# Altium schematic sheet 12 FE-DBG.SchDoc
size 420 x 297 mm
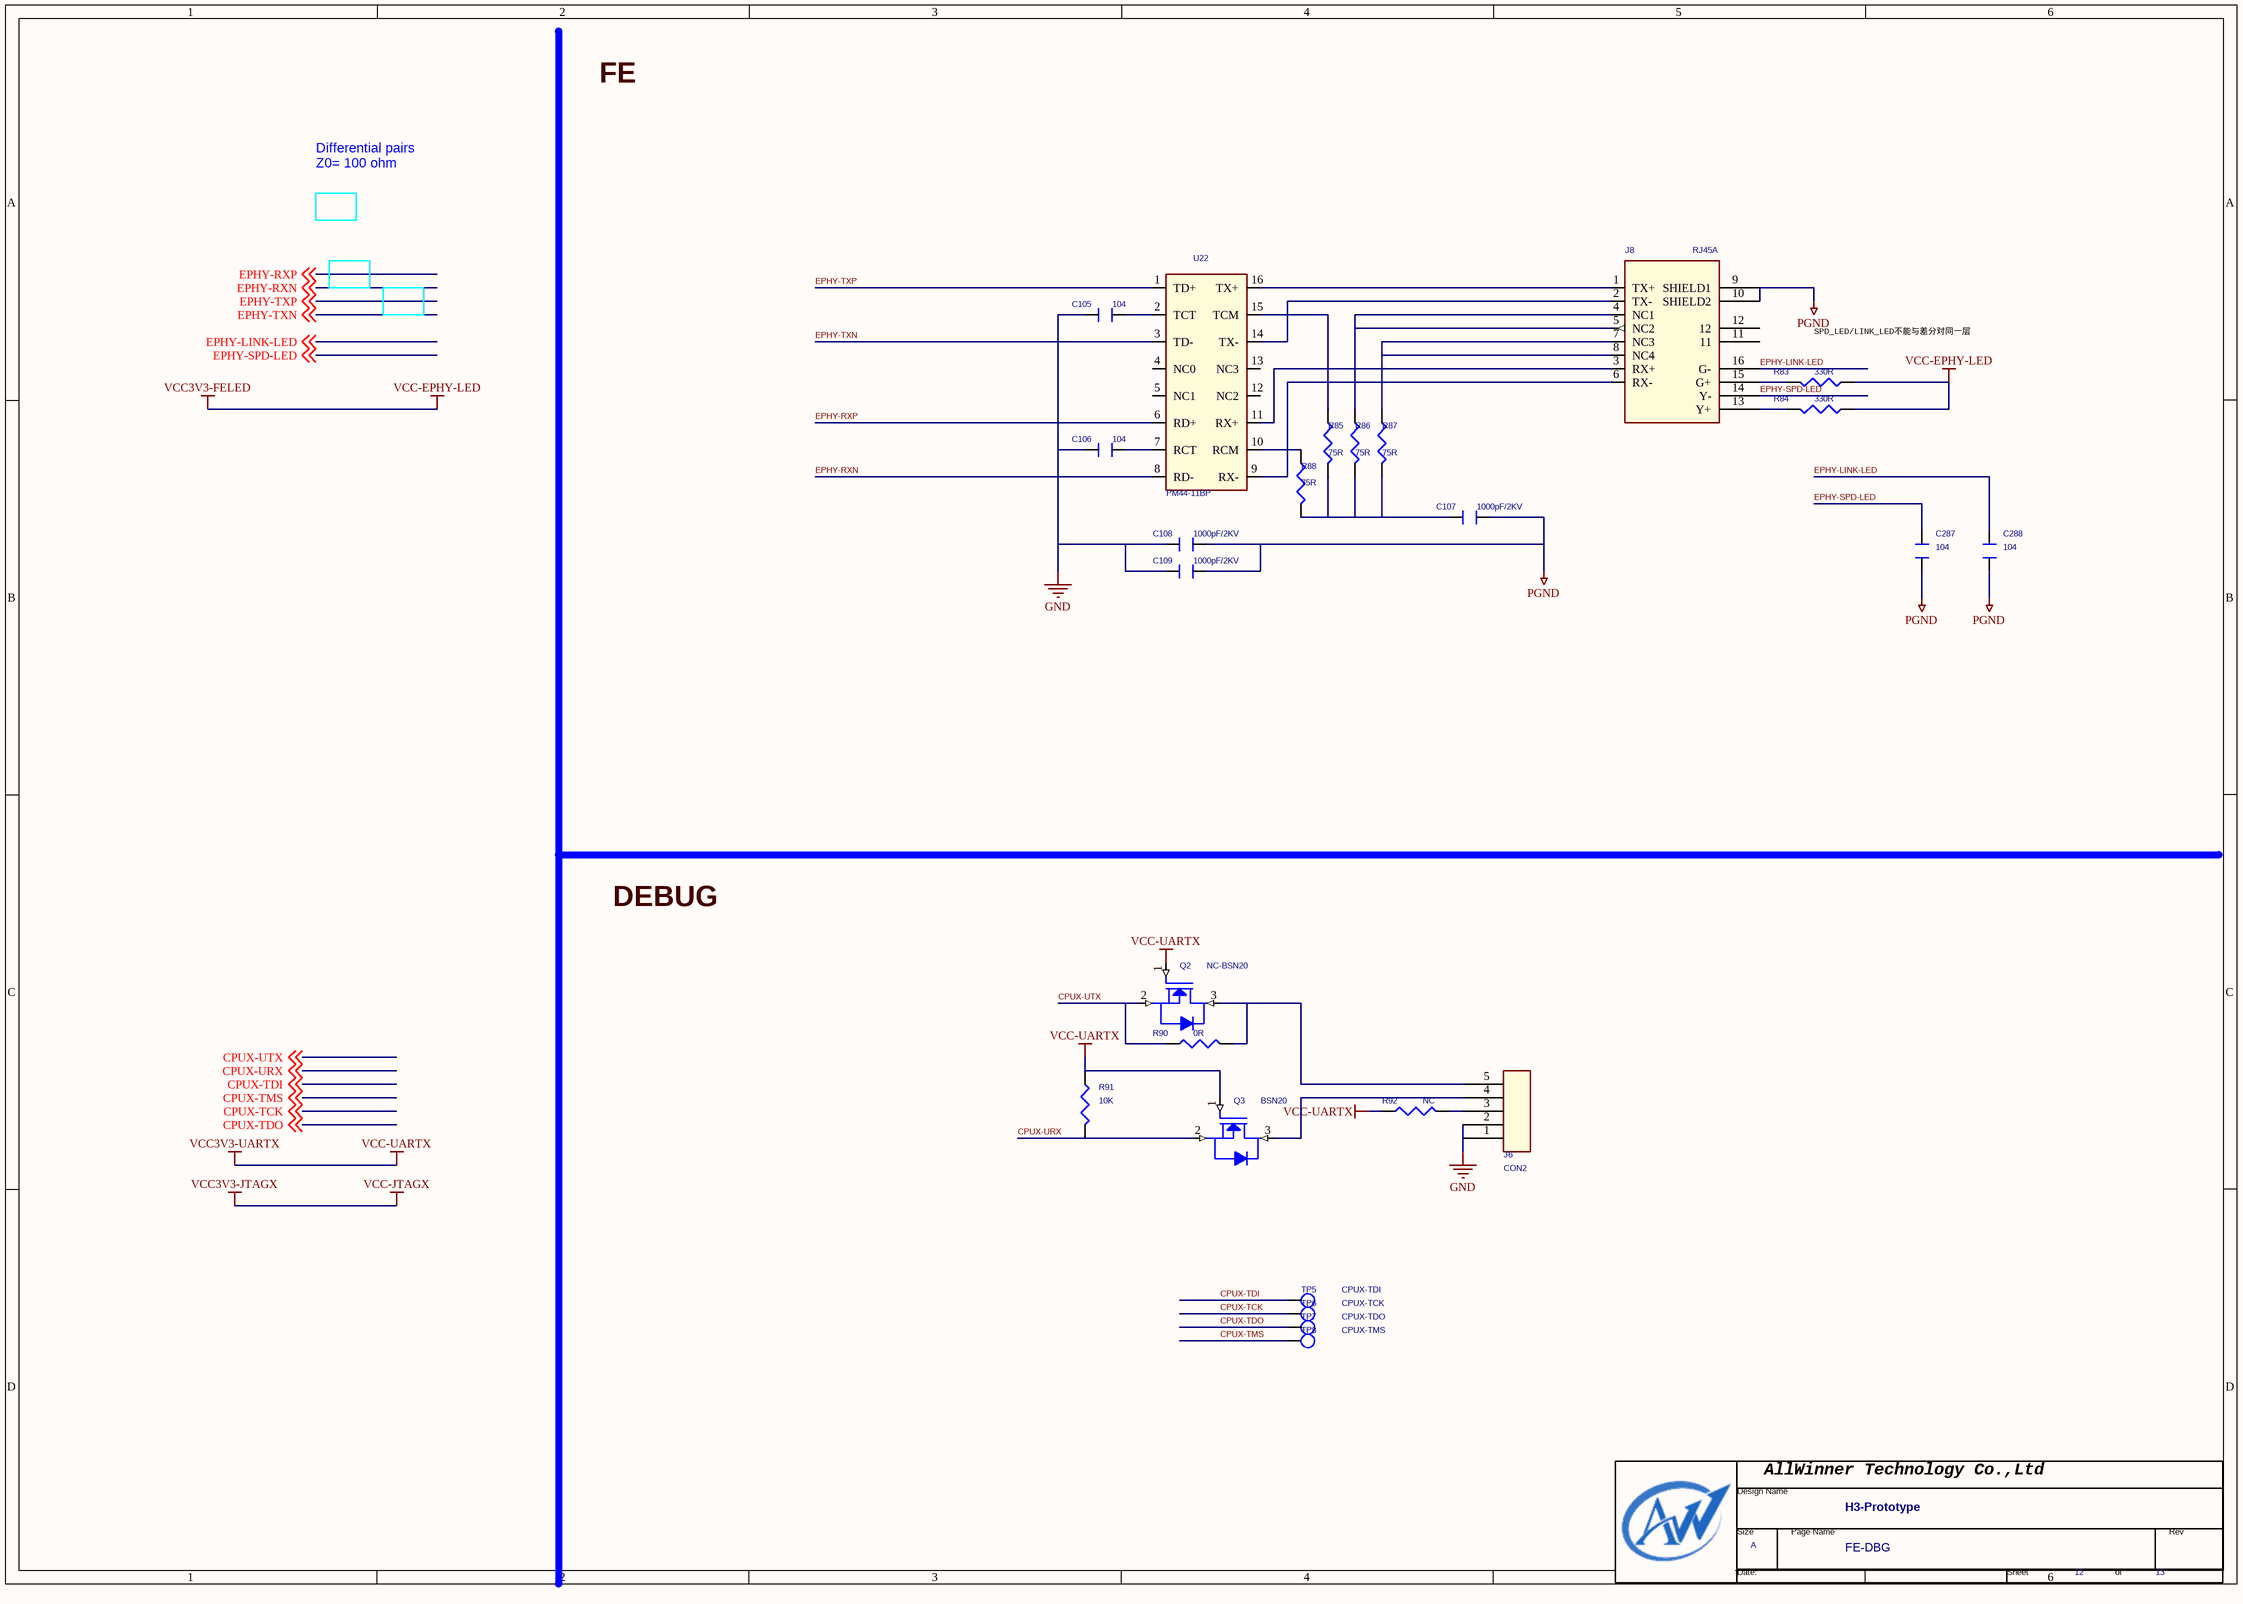
[diagram p0: 12 FE-DBG.SchDoc]

## Parts
*  Page Count: 13  Page Number: 12  Page Size: A  Title: H3-Prototype  Doc: FE-DBG  (hidden comment: TitleBlock0-AW)  (graphical)
C105  104  [0805]
C106  104  [0805]
C107  1000pF/2KV  [0805]
C108  1000pF/2KV  [0805]
C109  1000pF/2KV  [0805]
C287  104  [C0402]
C288  104  [C0402]
J6  CON2  [CON5]
J8  RJ45A  [LU1SO41A]
Q2  NC-BSN20  [sot-23]
Q3  BSN20  [sot-23]
R83  330R  [0805]
R84  330R  [0805]
R85  75R  [0805]
R86  75R  [0805]
R87  75R  [0805]
R88  75R  [0805]
R90  0R  [0805]
R91  10K  [0805]
R92  NC  [0805]
TP5  CPUX-TDI  [TP_SMD]
TP6  CPUX-TCK  [TP_SMD]
TP7  CPUX-TDO  [TP_SMD]
TP8  CPUX-TMS  [TP_SMD]
U22  PM44-11BP  [SOP16P1_27B6_86X12_70H6_0]

## Nets
GND: C105.2 C106.2 C108.2 C109.2 J6.1 J6.2
PGND: C107.1 C108.1 C109.1 C287.1 C288.1 J8.9(SHIELD1) J8.10(SHIELD2)
VCC-EPHY-LED: R83.1 R84.1  [also labelled VCC3V3-FELED]
VCC-UARTX: Q2.1(GATE) Q3.1(GATE) R91.1 R92.1  [also labelled VCC3V3-UARTX]
CPUX-TCK: TP6.1(TP) ; off-sheet CPUX-TCK
CPUX-TDI: TP5.1(TP) ; off-sheet CPUX-TDI
CPUX-TDO: TP7.1(TP) ; off-sheet CPUX-TDO
CPUX-TMS: TP8.1(TP) ; off-sheet CPUX-TMS
CPUX-URX: Q3.2(SOURCE) R91.2 ; off-sheet CPUX-URX
CPUX-UTX: Q2.2(SOURCE) R90.1 ; off-sheet CPUX-UTX
EPHY-LINK-LED: C288.2 J8.16(G-) ; off-sheet EPHY-LINK-LED
EPHY-RXN: U22.8(RD-) ; off-sheet EPHY-RXN
EPHY-RXP: U22.6(RD+) ; off-sheet EPHY-RXP
EPHY-SPD-LED: C287.2 J8.14(Y-) ; off-sheet EPHY-SPD-LED
EPHY-TXN: U22.3(TD-) ; off-sheet EPHY-TXN
EPHY-TXP: U22.1(TD+) ; off-sheet EPHY-TXP
NetC105_1: C105.1 U22.2(TCT)
NetC106_1: C106.1 U22.7(RCT)
NetC107_2: C107.2 R85.2 R86.2 R87.2 R88.2
NetJ6_3: J6.3 R92.2
NetJ6_4: J6.4 Q3.3(DRAIN)
NetJ6_5: J6.5 Q2.3(DRAIN) R90.2
NetJ8_1: J8.1(TX+) U22.16(TX+)
NetJ8_2: J8.2(TX-) U22.14(TX-)
NetJ8_3: J8.3(RX+) U22.11(RX+)
NetJ8_4: J8.4(NC1) J8.5(NC2) R86.1
NetJ8_6: J8.6(RX-) U22.9(RX-)
NetJ8_7: J8.7(NC3) J8.8(NC4) R87.1
NetJ8_13: J8.13(Y+) R84.2
NetJ8_15: J8.15(G+) R83.2
NetR85_1: R85.1 U22.15(TCM)
NetR88_1: R88.1 U22.10(RCM)

Not connected (* = marked no-connect by the designer): J8 11 12; U22 4(NC0) 5(NC1) 12(NC2) 13(NC3)

## Notes on the sheet
- FE
- Differential pairs
  Z0= 100 ohm
- (near R83) SPD_LED/LINK_LED不能与差分对同一层
- DEBUG
- (in symbol TitleBlock0-AW) AllWinner Technology Co.,Ltd; Design Name; Size; Page Name; Rev; Date:; Sheet; of

## Library data of the parts
C105-C109 = CAP_1
C287 C288 = CAPACITOR_0_Dup1: PAGE: 6
J6 = CON2_2_Dup1
J8 = LU1S041A_0: Single RJ45 Connector Module with Integrated 10/100 Base-Tx magnetics; MANUFACTURER#: LU1S041A-43; Manufacturer: Bothhand; Part Number: LU1S041A-43
Q2 Q3 = NMOS_0_Dup1
R83-R88 = R1_0805_Dup2
R90-R92 = R1_0805_Dup1: ROOM: DRAM
TP5-TP8 = T_POINT_R
U22 = J_0
* = TitleBlock0-AW: Page Create Date: March  8, 1995